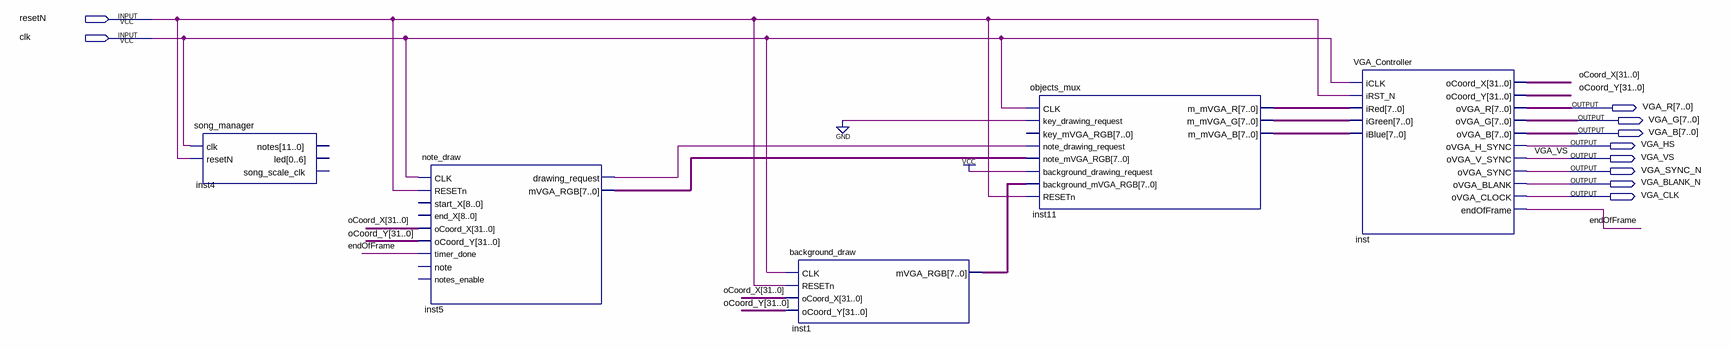
[diagram p0: schematic sheet]
// Quartus schematic vga_test.bdf as structural Verilog: 5 symbols, 10 pins
module vga_test (
  input  resetN,
  input  clk,
  output [7:0] VGA_R,
  output [7:0] VGA_G,
  output [7:0] VGA_B,
  output VGA_HS,
  output VGA_VS,
  output VGA_SYNC_N,
  output VGA_BLANK_N,
  output VGA_CLK
);

  wire endOfFrame, inst5_drawing_request;
  wire [7:0] inst1_mvga_rgb, inst5_mvga_rgb, inst11_m_mvga_b, inst11_m_mvga_g, inst11_m_mvga_r;
  wire [31:0] oCoord_X, oCoord_Y;

  song_manager inst4 (.clk(clk), .resetN(resetN));  // open: notes, led, song_scale_clk
  note_draw inst5 (
    .CLK(clk), .RESETn(resetN), .oCoord_X(oCoord_X), .oCoord_Y(oCoord_Y), .timer_done(endOfFrame),
    .drawing_request(inst5_drawing_request), .mVGA_RGB(inst5_mvga_rgb));  // open: start_X, end_X, note, notes_enable
  background_draw inst1 (
    .CLK(clk), .RESETn(resetN), .oCoord_X(oCoord_X), .oCoord_Y(oCoord_Y), .mVGA_RGB(inst1_mvga_rgb));
  objects_mux inst11 (
    .CLK(clk), .key_drawing_request(1'b0), .note_drawing_request(inst5_drawing_request),
    .note_mVGA_RGB(inst5_mvga_rgb), .background_drawing_request(1'b1), .background_mVGA_RGB(inst1_mvga_rgb),
    .RESETn(resetN), .m_mVGA_R(inst11_m_mvga_r), .m_mVGA_G(inst11_m_mvga_g), .m_mVGA_B(inst11_m_mvga_b));  // open: key_mVGA_RGB
  VGA_Controller inst (
    .iCLK(clk), .iRST_N(resetN), .iRed(inst11_m_mvga_r), .iGreen(inst11_m_mvga_g), .iBlue(inst11_m_mvga_b),
    .oCoord_X(oCoord_X), .oCoord_Y(oCoord_Y), .oVGA_R(VGA_R), .oVGA_G(VGA_G), .oVGA_B(VGA_B),
    .oVGA_H_SYNC(VGA_HS), .oVGA_V_SYNC(VGA_VS), .oVGA_SYNC(VGA_SYNC_N), .oVGA_BLANK(VGA_BLANK_N),
    .oVGA_CLOCK(VGA_CLK), .endOfFrame(endOfFrame));
endmodule
